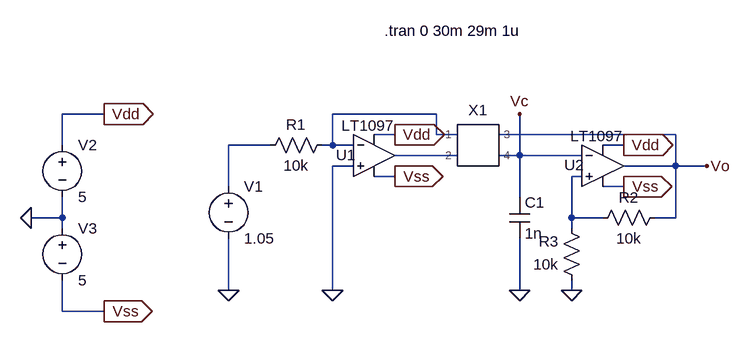
[diagram p0: schematic voltage_controlled_oscillator.asc]
voltage_controlled_oscillator.asc, the LTspice schematic file:
Version 4
SHEET 1 880 680
WIRE -144 64 -208 64
WIRE 368 64 208 64
WIRE 304 96 272 96
WIRE 368 96 368 64
WIRE 400 96 368 96
WIRE 736 96 464 96
WIRE -208 112 -208 64
WIRE 112 112 48 112
WIRE 208 112 208 64
WIRE 208 112 192 112
WIRE 240 112 208 112
WIRE 656 112 624 112
WIRE 400 128 304 128
WIRE 496 128 496 64
WIRE 496 128 464 128
WIRE 592 128 496 128
WIRE 240 144 208 144
WIRE 736 144 736 96
WIRE 736 144 656 144
WIRE 784 144 736 144
WIRE 304 160 272 160
WIRE 592 160 576 160
WIRE 48 176 48 112
WIRE 656 176 624 176
WIRE 496 192 496 128
WIRE -208 224 -208 192
WIRE -208 224 -256 224
WIRE 576 224 576 160
WIRE 624 224 576 224
WIRE 736 224 736 144
WIRE 736 224 704 224
WIRE -208 240 -208 224
WIRE 576 240 576 224
WIRE 48 336 48 256
WIRE 208 336 208 144
WIRE 496 336 496 256
WIRE 576 336 576 320
WIRE -208 368 -208 320
WIRE -144 368 -208 368
FLAG 208 336 0
FLAG 48 336 0
FLAG 496 336 0
FLAG 576 336 0
FLAG -256 224 0
FLAG -144 64 Vdd
IOPIN -144 64 Out
FLAG -144 368 Vss
IOPIN -144 368 Out
FLAG 656 112 Vdd
IOPIN 656 112 Out
FLAG 656 176 Vss
IOPIN 656 176 Out
FLAG 304 96 Vdd
IOPIN 304 96 Out
FLAG 304 160 Vss
IOPIN 304 160 Out
FLAG 496 64 Vc
FLAG 784 144 Vo
SYMBOL res 208 96 R90
WINDOW 0 0 56 VBottom 2
WINDOW 3 32 56 VTop 2
SYMATTR InstName R1
SYMATTR Value 10k
SYMBOL ZX1 416 144 R0
SYMATTR InstName X1
SYMBOL voltage 48 160 R0
WINDOW 123 0 0 Left 0
WINDOW 39 0 0 Left 0
SYMATTR InstName V1
SYMATTR Value 1.05
SYMBOL cap 480 192 R0
SYMATTR InstName C1
SYMATTR Value 1n
SYMBOL res 720 208 R90
WINDOW 0 0 56 VBottom 2
WINDOW 3 32 56 VTop 2
SYMATTR InstName R2
SYMATTR Value 10k
SYMBOL res 592 336 R180
WINDOW 0 36 76 Left 2
WINDOW 3 36 40 Left 2
SYMATTR InstName R3
SYMATTR Value 10k
SYMBOL voltage -208 96 R0
WINDOW 123 0 0 Left 0
WINDOW 39 0 0 Left 0
SYMATTR InstName V2
SYMATTR Value 5
SYMBOL voltage -208 224 R0
WINDOW 123 0 0 Left 0
WINDOW 39 0 0 Left 0
SYMATTR InstName V3
SYMATTR Value 5
SYMBOL OpAmps\\LT1097 624 80 R0
WINDOW 0 -59 63 Left 2
WINDOW 3 -50 18 Left 2
SYMATTR InstName U2
SYMBOL OpAmps\\LT1097 272 64 R0
WINDOW 0 -59 63 Left 2
WINDOW 3 -50 18 Left 2
SYMATTR InstName U1
TEXT 288 -64 Left 2 !.tran 0 30m 29m 1u

The netlist it stands for:
* voltage_controlled_oscillator.asc
R1 N001 N002 10k
XX1 N001 N003 Vo Vc ZX1  ; pins 1 2 3 4
V1 N002 0 1.05
C1 Vc 0 1n
R2 Vo N004 10k
R3 0 N004 10k
V2 Vdd 0 5
V3 0 Vss 5
XU2 N004 Vc Vdd Vss Vo LT1097  ; pins In+ In- V+ V- OUT
XU1 0 N001 Vdd Vss N003 LT1097  ; pins In+ In- V+ V- OUT
.tran 0 30m 29m 1u
.backanno
.end